# EAGLE design cLCD (EAGLE 4.16)
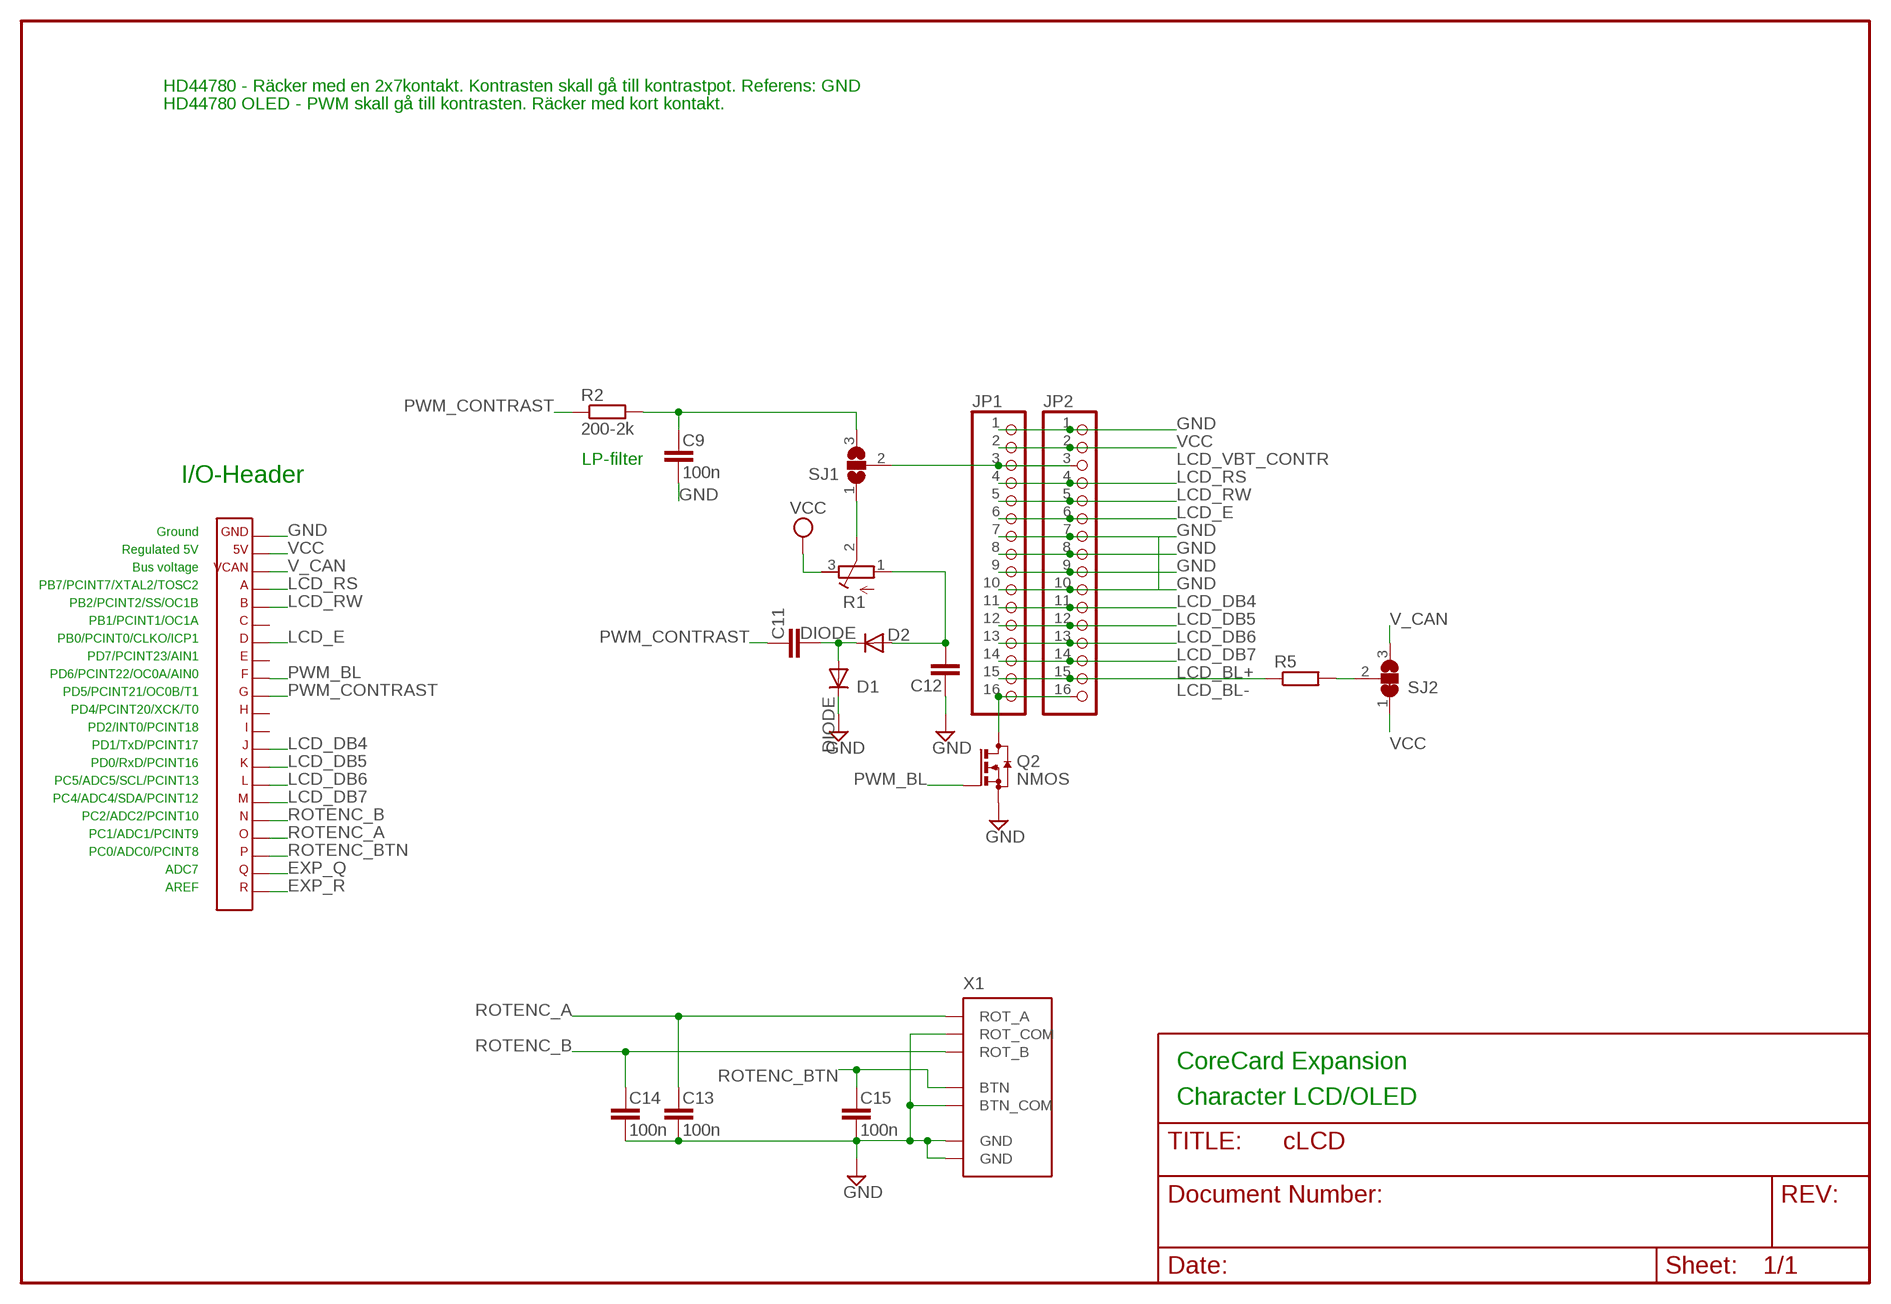
[diagram p0: schematic, sheet 1]

## Parts
C9  100n  C-EUC0603  [C0603]
C11  C-EUC0603  [C0603]
C12  C-EUC0603  [C0603]
C13  100n  C-EUC0603  [C0603]
C14  100n  C-EUC0603  [C0603]
C15  100n  C-EUC0603  [C0603]
D1  DIODE  [SOD323]
D2  DIODE  [SOD323]
JP1  PINHD-2X08  [2X08]
JP2  PINHD-1X16  [1X16]
Q2  NMOS  [SOT23]
R1  R-TRIM  [TRIM_PVZ3]
R2  200-2k  R-EUR0603  [R0603]
R5  R-EUR0603  [R0603]
SJ1  SJ_2_NOS  [SJ_2_NO_SMALL]
SJ2  SJ_2_NO_NCSMALL  [SJ_2_NO_NC_SMALL]
X1  ROTENC  [HOLE]
X3  CORE_IOHEADEXP  [CORE_IOHEAD_NOSILC]

## Nets
EXP_Q: X3.20
EXP_R: X3.21
FILT_PWM_CONTRAST: C9.1 R2.2 SJ1.3
GND: C9.2 C12.1 C13.2 C14.2 C15.2 D1.C JP1.1 JP1.7 JP1.8 JP1.9 JP1.10 JP2.1 JP2.7 JP2.8 JP2.9 JP2.10 Q2.2(S) X1.2(ROT_COM) X1.5(BTN_COM) X1.GND@1(GND) X1.GND@2(GND) X3.1
LCD_BL+: JP1.15 JP2.15 R5.1
LCD_BL-: JP1.16 JP2.16 Q2.3(D)
LCD_DB4: JP1.11 JP2.11 X3.13
LCD_DB5: JP1.12 JP2.12 X3.14
LCD_DB6: JP1.13 JP2.13 X3.15
LCD_DB7: JP1.14 JP2.14 X3.16
LCD_E: JP1.6 JP2.6 X3.7
LCD_RS: JP1.4 JP2.4 X3.4
LCD_RW: JP1.5 JP2.5 X3.5
LCD_VBT_CONTR: JP1.3 JP2.3 SJ1.2
N$1: R5.2 SJ2.2
NEG_INTERNAL_NODE: C11.2 D1.A D2.C
NEG_VOLT_CONTRAST: C12.2 D2.A R1.1(PAD1)
POT_VOLT_CONTRAST: R1.2(PAD2) SJ1.1
PWM_BL: Q2.1(G) X3.9
PWM_CONTRAST: C11.1 R2.1 X3.10
ROTENC_A: C13.1 X1.1(ROT_A) X3.18
ROTENC_B: C14.1 X1.3(ROT_B) X3.17
ROTENC_BTN: C15.1 X1.4(BTN) X3.19
V_CAN: SJ2.3 X3.3
VCC: JP1.2 JP2.2 R1.3(PAD3) SJ2.1 X3.2
Unconnected: X3.6 X3.8 X3.11 X3.12

## Notes on the sheet
- HD44780 - Räcker med en 2x7kontakt. Kontrasten skall gå till kontrastpot. Referens: GND
- HD44780 OLED - PWM skall gå till kontrasten. Räcker med kort kontakt.
- LP-filter
- I/O-Header
- Ground
- Regulated 5V
- Bus voltage
- PB7/PCINT7/XTAL2/TOSC2
- PB2/PCINT2/SS/OC1B
- PB1/PCINT1/OC1A
- PB0/PCINT0/CLKO/ICP1
- PD7/PCINT23/AIN1
- PD6/PCINT22/OC0A/AIN0
- PD5/PCINT21/OC0B/T1
- PD4/PCINT20/XCK/T0
- PD2/INT0/PCINT18
- PD1/TxD/PCINT17
- PD0/RxD/PCINT16
- PC5/ADC5/SCL/PCINT13
- PC4/ADC4/SDA/PCINT12
- PC2/ADC2/PCINT10
- PC1/ADC1/PCINT9
- PC0/ADC0/PCINT8
- ADC7
- AREF
- CoreCard Expansion
- Character LCD/OLED

## Library data of the parts
C9 C11-C15 = rcl:C-EU
D1 D2 = diode:DIODE: DIODE ultra fast rectifier, 3 A
JP1 = pinhead-mm:PINHD-2X08
JP2 = pinhead-mm:PINHD-1X16
Q2 = transistor:NMOS
R1 = rcl:R-TRIM
R2 R5 = rcl:R-EU
SJ1 = jumper:SJ_2_NO
SJ2 = jumper:SJ_2_NO_NC
X1 = rot_encoder:ROTENC
X3 = expboard:CORE_IOHEAD: CoreCard IO-header for expansion cards

## Board
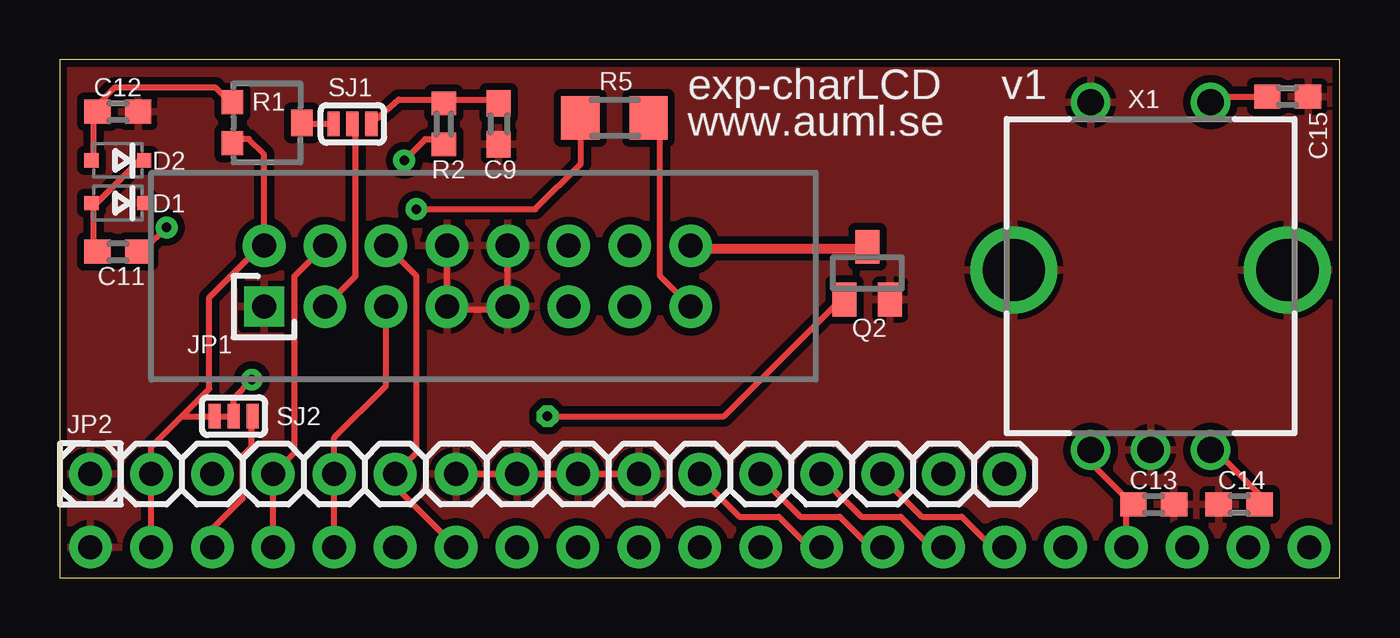
[diagram p1: board, top side]
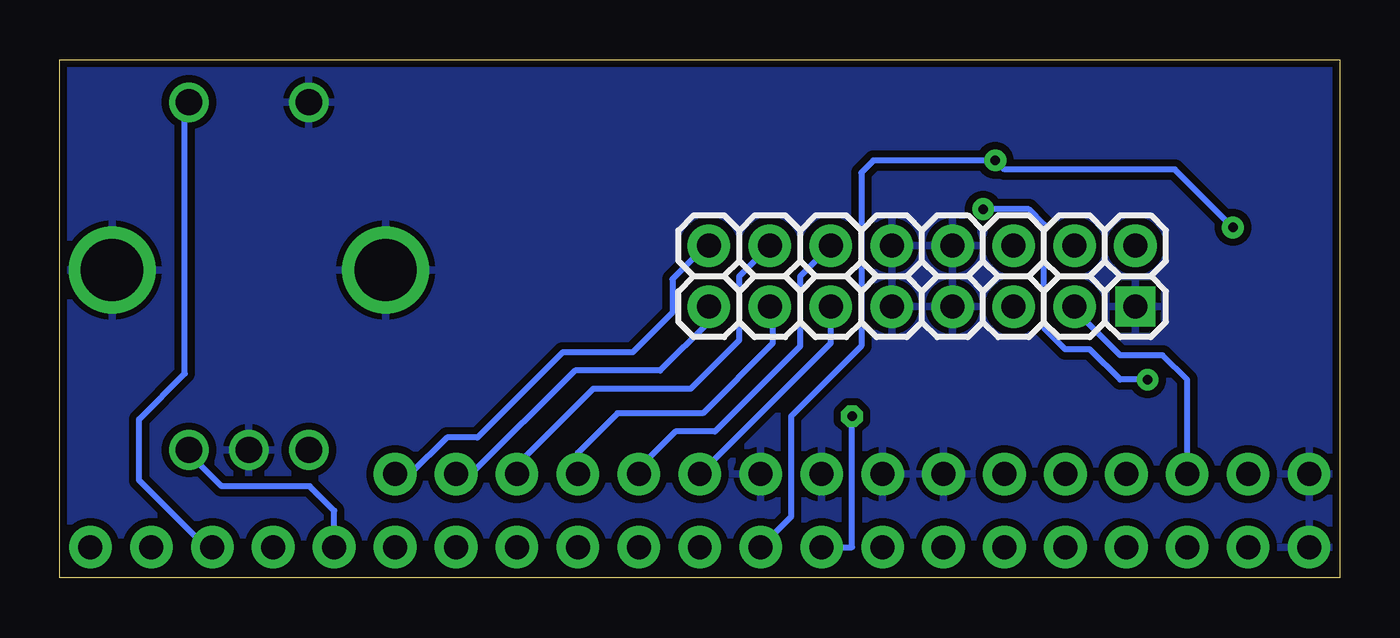
[diagram p2: board, bottom side, seen from below]

Size 53.34 x 21.59 mm. Coordinates in mm from the lower left corner, seen from the top.
Outline: 0,0 53.34,0 53.34,21.59 0,21.59 0,0
Copper layers (1*16): Top 0.035mm / dielectric 1.5mm / Bottom 0.035mm
Design rules "default": minimum track width 10mil, minimum drill 0.4mm, track to track 10mil, track to pad 10mil, pad to pad 10mil, via to via 10mil, smd to smd 8mil, copper to edge 10mil, drill to drill 8mil, minimum pad ring 10mil, minimum via ring 10mil, stop-mask expansion 4mil, vias tented up to drill 18mil, thermal gap 10mil

### Footprints (pad centres in the part's own frame; a part is rotated, then mirrored left to right if it is on the bottom)
C0603 = smd 1.1 x 1: 1 -0.85,0; 2 0.85,0
SOD323 = smd 0.6 x 0.6: A 1.1,0; C -1.1,0
2X08 = drill 1 pad 1.676 square: 1 -8.89,1.27 | drill 1 pad 1.778 round: 2 -8.89,-1.27; 3 -6.35,1.27; 4 -6.35,-1.27; 5 -3.81,1.27; 6 -3.81,-1.27; 7 -1.27,1.27; 8 -1.27,-1.27; 9 1.27,1.27; 10 1.27,-1.27; 11 3.81,1.27; 12 3.81,-1.27; 13 6.35,1.27; 14 6.35,-1.27; 15 8.89,1.27; 16 8.89,-1.27
1X16 = drill 1 pad 1.778 round: 1 -19.05,0; 2 -16.51,0; 3 -13.97,0; 4 -11.43,0; 5 -8.89,0; 6 -6.35,0; 7 -3.81,0; 8 -1.27,0; 9 1.27,0; 10 3.81,0; 11 6.35,0; 12 8.89,0; 13 11.43,0; 14 13.97,0; 15 16.51,0; 16 19.05,0
SOT23 = smd 1 x 1.4: 1 -0.95,-1.1; 2 0.95,-1.1; 3 0,1.1
TRIM_PVZ3 = smd 1 x 0.9: 1 0.5,0.45; 3 2.2,0.45 | smd 1.1 x 0.9: 2 1.35,3.35
R0603 = smd 0.991 x 1.016: 1 -0.85,0; 2 0.85,0
R1206 = smd 1.6 x 1.803: 1 -1.422,0; 2 1.422,0
SJ_2_NO_SMALL = smd 0.508 x 1.016: 1 -0.787,0; 2 0,0; 3 0.787,0
SJ_2_NO_NC_SMALL = smd 0.508 x 1.016: 1 -0.787,0; 2 0,0; 3 0.787,0
HOLE = drill 1.1 round: 1 -2.5,-7.5; 2 0,-7.5; 3 2.5,-7.5; 4 2.5,7; 5 -2.5,7 | drill 2.6 round: GND@1 -5.7,0; GND@2 5.7,0
CORE_IOHEAD_NOSILC = drill 1 pad 1.778 round: 1 25.4,0; 2 22.86,0; 3 20.32,0; 4 17.78,0; 5 15.24,0; 6 12.7,0; 7 10.16,0; 8 7.62,0; 9 5.08,0; 10 2.54,0; 11 0,0; 12 -2.54,0; 13 -5.08,0; 14 -7.62,0; 15 -10.16,0; 16 -12.7,0; 17 -15.24,0; 18 -17.78,0; 19 -20.32,0; 20 -22.86,0; 21 -25.4,0

### Placement (x,y rotation side)
C9  18.29,18.92 270 top
C11  2.41,13.59 180 top
C12  2.41,19.43 180 top
C13  45.59,3.05 0 top
C14  49.15,3.05 180 top
C15  51.18,20.07 0 top
D1  2.41,15.62 180 top
D2  2.41,17.4 180 top
JP1  17.4,12.57 180 bottom
JP2  20.32,4.32 0 top
Q2  33.66,12.7 0 top
R1  6.73,20.32 270 top
R2  16,18.92 90 top
R5  [R1206]  23.11,19.18 180 top
SJ1  12.19,18.92 0 top
SJ2  7.24,6.73 0 top
X1  45.47,12.83 0 top
X3  26.67,1.27 0 bottom

### Tracks (layer width: path | path; a pad name or v marks a point on that pad's centre or on a via)
FILT_PWM_CONTRAST
  Top 0.254: SJ1.3 14.12,19.94 15.62,19.94 R2.2 16.17,19.94 18.29,19.94 C9.1
GND
  Top 0.254: JP2.10 JP2.9 JP2.8 JP2.7 16.38,4.32 | JP1.10 JP1.9 18.67,11.18 16.13,11.18 | JP1.7 16.13,11.18 | 16.13,11.18 JP1.8
  pour Bottom (isolate 0.305, rank 3): 0,21.59 53.34,21.59 53.34,1.14 0,1.14
  pour Top (isolate 0.305, rank 3): 0,21.59 53.34,21.59 53.34,1.14 0,1.14
LCD_BL+
  Top 0.254: JP1.15 25.02,12.57 25.02,19.3 R5.1
  Bottom 0.254: JP2.15 36.2,4.32 31.88,8.64 28.32,8.64 26.29,10.67 JP1.15
LCD_BL-
  Top 0.406: Q2.3 33.4,13.8 33.53,13.72 26.29,13.72 JP1.16
  Bottom 0.254: JP2.16 38.73,4.32 37.21,5.84 35.94,5.84 32.38,9.4 29.46,9.4 27.81,11.05 27.81,12.45 26.42,13.84 JP1.16
LCD_DB4
  Top 0.254: JP2.11 26.67,4.19 28.32,2.54 29.97,2.54 31.24,1.27 X3.13
  Bottom 0.254: JP2.11 21.21,9.78 JP1.11
LCD_DB5
  Top 0.254: JP2.12 29.21,4.19 30.86,2.54 32.51,2.54 33.78,1.27 X3.14
  Bottom 0.254: JP1.12 22.48,12.57 22.48,9.65 26.04,6.1 27.69,6.1 29.21,4.57 JP2.12
LCD_DB6
  Top 0.254: JP2.13 31.75,4.19 33.4,2.54 35.05,2.54 36.32,1.27 X3.15
  Bottom 0.254: JP1.13 23.62,11.3 23.62,9.78 26.54,6.86 30.1,6.86 31.75,5.21 JP2.13
LCD_DB7
  Top 0.254: JP2.14 34.29,4.19 35.94,2.54 37.59,2.54 38.86,1.27 X3.16
  Bottom 0.254: JP1.14 25.02,12.57 25.02,9.91 27.05,7.87 31.11,7.87 34.29,4.7 JP2.14
LCD_E
  Top 0.254: JP1.6 14.86,12.57 14.86,5.21 JP2.6 13.97,3.81 X3.7
LCD_RS
  Top 0.254: JP1.4 9.78,12.57 9.78,5.21 JP2.4 X3.4
LCD_RW
  Top 0.254: JP1.5 13.59,8 11.43,5.84 JP2.5 X3.5
LCD_VBT_CONTR
  Top 0.254: JP1.3 12.32,12.57 12.32,18.67 SJ1.2
  Bottom 0.254: JP1.3 11.05,11.18 9.14,9.27 7.37,9.27 6.35,8.26 JP2.3
N$1  (via drill 0.4)
  Top 0.254: R5.2 21.72,17.27 19.81,15.37 v14.86,15.37 | v8,8.26 7.24,7.49 SJ2.2
  Bottom 0.254: v14.86,15.37 12.95,15.37 12.32,14.73 12.32,10.41 11.43,9.53 10.41,9.53 9.14,8.26 v8,8.26
NEG_INTERNAL_NODE
  Top 0.254: 3.56,17.4 D2.C 3.3,17.4 1.52,15.62 D1.A 1.4,15.62 1.4,13.76 C11.2
NEG_VOLT_CONTRAST
  Top 0.254: D2.A 1.4,17.48 1.4,19.43 C12.2 1.52,19.47 1.52,19.68 2.29,20.45 6.48,20.45 7.11,19.81 7.12,19.82 R1.1 6.87,19.82
POT_VOLT_CONTRAST
  Top 0.254: R1.2 10.16,18.92 SJ1.1
PWM_BL  (via drill 0.4)
  Top 0.254: Q2.1 32.72,11.6 32.51,11.56 27.69,6.73 v20.32,6.73
  Bottom 0.254: X3.9 20.32,1.27 v20.32,6.73
PWM_CONTRAST  (via drill 0.4)
  Top 0.254: v14.35,17.4 15.24,18.29 15.62,18.29 15.96,18.2 R2.1 | C11.1 3.52,13.68 v4.45,14.61
  Bottom 0.254: X3.10 22.86,2.54 22.86,6.73 19.94,9.65 19.94,16.89 19.43,17.4 v14.35,17.4 13.97,17.02 6.86,17.02 v4.45,14.61
ROTENC_A
  Top 0.254: X3.18 44.45,3.3 | 44.45,3.3 C13.1 | 43.05,5.33 43.06,5.33 X1.1 43.09,5.33 43.05,5.33 | 44.45,3.3 43.05,4.7 43.05,5.33
ROTENC_B
  Top 0.254: C14.1 50.04,3.43 48.13,5.33 48.1,5.33 X1.3
  Bottom 0.254: X3.17 41.91,2.79 42.93,3.81 46.61,3.81 48.13,5.33 X1.3
ROTENC_BTN
  Top 0.254: X1.4 48.12,19.83 48.13,19.81 48.39,20.07 C15.1
  Bottom 0.254: X3.19 47.24,1.27 50.04,4.06 50.04,6.6 48.13,8.51 48.13,19.81 48.12,19.83 X1.4
V_CAN
  Top 0.254: X3.3 6.35,2.03 7.62,3.3 7.62,5.08 8,5.46 8,6.73 SJ2.3
VCC
  Top 0.254: R1.3 7.18,18.48 6.99,18.29 7.87,18.29 8.51,17.65 JP1.2 8.51,13.72 8.26,13.72 6.22,11.68 6.22,7.87 5.08,6.73 | 5.08,6.73 3.81,5.46 JP2.2 X3.2 | 5.08,6.73 SJ2.1

### Text on the board
tPlace: exp-charLCD | v1 | www.auml.se
Document: Top is component side | Expansion will be mounted bottom to bottom with CoreCard | Change vertical dimension to fit | Remove I/O-header silcscreen if neccesary | Remove mounting holes if neccesary
tDocu: IDC connector